# Altium project Version 1.PrjPcb
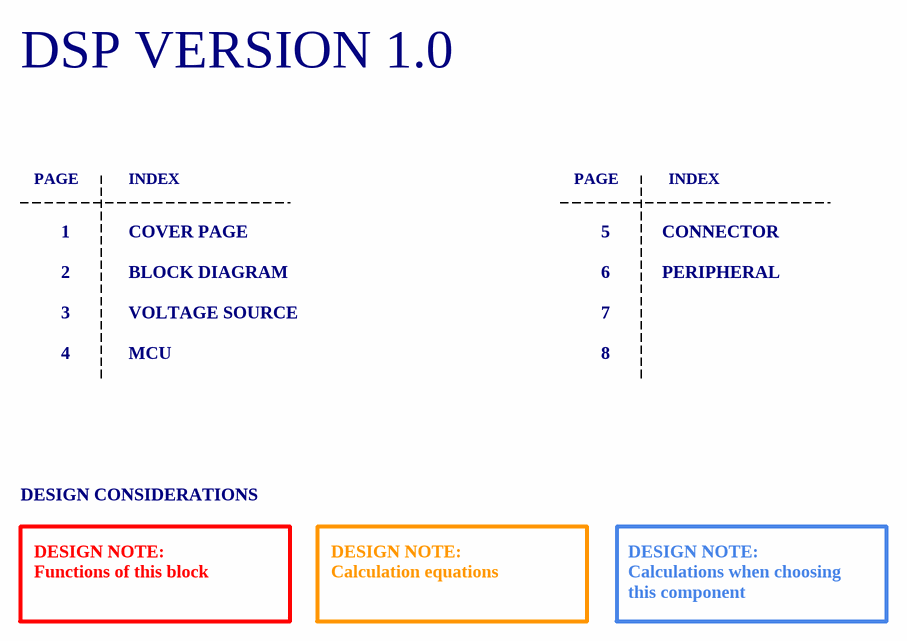
[diagram p0: Cover Page.SchDoc]
6 sheets, 80 parts. Net scope: global (net labels, ports and power ports of the same name join across sheets).
Board file: PCB_cut_wire.PcbDoc
Sheets:
  Cover Page.SchDoc
  Block Diagram.SchDoc
  Voltage Source.SchDoc
  Micro Controller.SchDoc
  Peripheral.SchDoc
  Connector.SchDoc

## Sheet Cover Page.SchDoc: Cover Page
size A4; Author: DODANHLUONG; Revision: 1.0; SheetNumber: 1; SheetTotal: 6; ProjectTitle: DSP_VERSION_1.0

### Notes on the sheet
- DSP VERSION 1.0
- PAGE
- INDEX
- 1
- 2
- COVER PAGE
- BLOCK DIAGRAM
- 5
- 6
- CONNECTOR
- PERIPHERAL
- 3
- 4
- VOLTAGE SOURCE
- MCU
- 7
- 8
- DESIGN CONSIDERATIONS
- DESIGN NOTE:
  Functions of this block
- DESIGN NOTE:
  Calculation equations
- DESIGN NOTE:
  Calculations when choosing this component
- Author:
- Title:
- Size:
- A4
- Project:
- Approved:
- Revision:
- Modified Date:
- CONFIDENTIAL
- Date:
- SW Version:

## Sheet Block Diagram.SchDoc
size A4; SheetNumber: 2; SheetTotal: 6; ProjectTitle: DSP_VERSION_1.0

### Notes on the sheet
- Author:
- Title:
- Size:
- A4
- Project:
- Approved:
- Revision:
- Modified Date:
- CONFIDENTIAL
- Date:
- SW Version:

## Sheet Voltage Source.SchDoc
size A3; SheetNumber: 3; SheetTotal: 6; ProjectTitle: DSP_VERSION_1.0
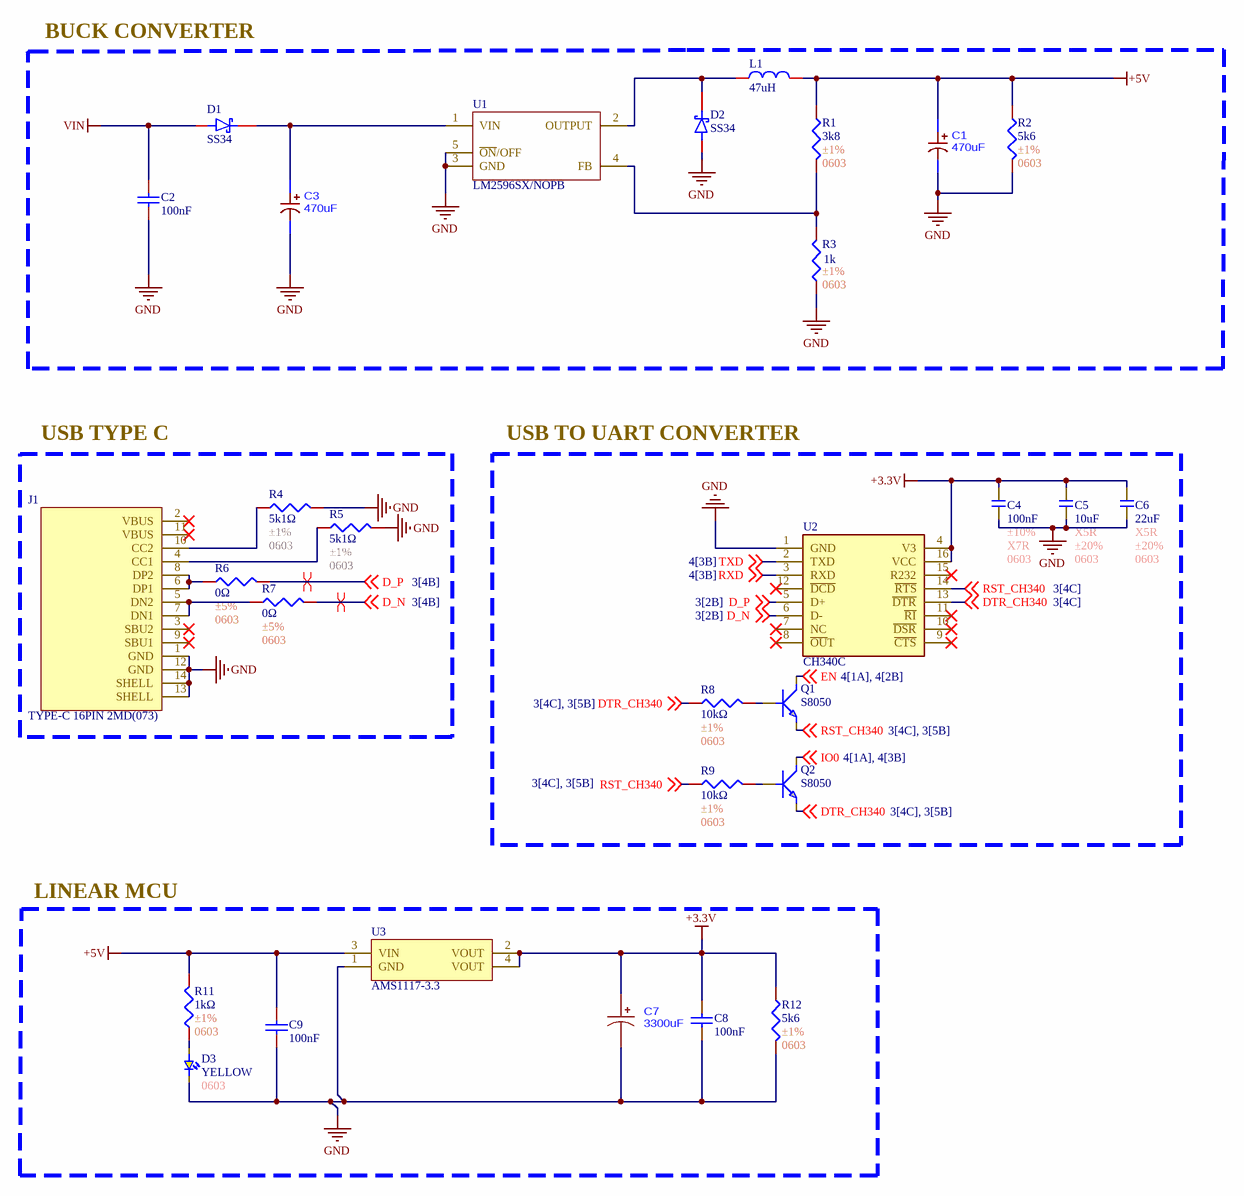
[diagram p1: Voltage Source.SchDoc]

### Parts
C1  470uF  [470uF 35V, D10xL13mm]
C2  100nF  [tu tantalum dip5.08]
C3  470uF  [470uF 35V, D10xL13mm]
C4  100nF  Tolerance: ±10%  Temperature Coefficient: X7R  Package: 0603  [C0603]
C5  10uF  Temperature Coefficient: X5R  Tolerance: ±20%  Package: 0603  [C0603]
C6  22uF  Temperature Coefficient: X5R  Tolerance: ±20%  Package: 0603  [C0603]
C7  3300uF  [Through Hole,D8xL16mm]
C8  100nF  [tu tantalum dip5.08]
C9  100nF  [tu tantalum dip5.08]
D1  SS34  [SS34]
D2  SS34  [SS34]
D3  YELLOW  Package: 0603  [LED0603]
J1  TYPE-C 16PIN 2MD(073)  [TYPE_C_FAMALE]
L1  47uH  [CD43]
Q1  S8050  [S8050]
Q2  S8050  [S8050]
R1  3k8  Tolerance: ±1%  Package: 0603  [R0603]
R2  5k6  Tolerance: ±1%  Package: 0603  [R0603]
R3  1k  Tolerance: ±1%  Package: 0603  [R0603]
R4  5k1Ω  Tolerance: ±1%  Package: 0603  [R0603]
R5  5k1Ω  Tolerance: ±1%  Package: 0603  [R0603]
R6  0Ω  Tolerance: ±5%  Package: 0603  [R0603]
R7  0Ω  Tolerance: ±5%  Package: 0603  [R0603]
R8  10kΩ  Tolerance: ±1%  Package: 0603  [R0603]
R9  10kΩ  Tolerance: ±1%  Package: 0603  [R0603]
R11  1kΩ  Tolerance: ±1%  Package: 0603  [R0603]
R12  5k6  Tolerance: ±1%  Package: 0603  [R0603]
U1  LM2596SX/NOPB  [LM2596SX-5.0/NOPB]
U2  CH340C  [CH340C]
U3  AMS1117-3.3  [AMS1117-3.3]

### Blocks framed on the sheet
BUCK CONVERTER: C1-C3 D1 D2 L1 R1-R3 U1
USB TYPE C: J1 R4-R7
USB TO UART CONVERTER: C4-C6 Q1 Q2 R8 R9 U2
LINEAR MCU: C7-C9 D3 R11 R12 U3

### Nets
+3.3V: C4.2 C5.2 C6.2 C7.1 C8.2 R12.1 U2.4(V3) U2.16(VCC) U3.2(VOUT) U3.4(VOUT)
+5V: C1.1 C9.2 L1.2 R1.1 R2.1 R11.2 U3.3(VIN)
GND: C1.2 C2.1 C3.2 C4.1 C5.1 C6.1 C7.2 C8.1 C9.1 D2.2 D3.1 J1.1(GND) J1.12(GND) J1.13(SHELL) J1.14(SHELL) R2.2 R3.1 R4.2 R5.2 R12.2 U1.3(GND) U1.5(~{ON}/OFF) U2.1(GND) U3.1(GND)
VIN: C2.2 D1.2
D_N: R7.2 U2.6(D-) ; off-sheet D_N
D_P: R6.2 U2.5(D+) ; off-sheet D_P
DTR_CH340: Q2.2(E) R8.1 U2.13(~{DTR}) ; off-sheet DTR_CH340
EN: Q1.3(C) ; off-sheet EN
IO0: Q2.3(C) ; off-sheet IO0
RST_CH340: Q1.2(E) R9.1 U2.14(~{RTS}) ; off-sheet RST_CH340
RXD: U2.3(RXD) ; off-sheet RXD
TXD: U2.2(TXD) ; off-sheet TXD
NetC3_1: C3.1 D1.1 U1.1(VIN)
NetD2_1: D2.1 L1.1 U1.2(OUTPUT)
NetD3_2: D3.2 R11.1
NetJ1_4: J1.4(CC1) R5.1
NetJ1_5: J1.5(DN2) J1.7(DN1) R7.1
NetJ1_6: J1.6(DP1) J1.8(DP2) R6.1
NetJ1_10: J1.10(CC2) R4.1
NetQ1_1: Q1.1(B) R8.2
NetQ2_1: Q2.1(B) R9.2
NetR1_2: R1.2 R3.2 U1.4(FB)

Not connected (* = marked no-connect by the designer): J1 2(VBUS)* 3(SBU2)* 9(SBU1)* 11(VBUS)*; U2 7(NC)* 8(~{OU}T)* 9(~{CTS})* 10(~{DSR})* 11(~{RI})* 12(~{DCD})* 15(R232)*

### Layout directives
differential pair: D_N, D_P

### Notes on the sheet
- Author:
- Title:
- Size:
- A3
- Project:
- Revision:
- Modified Date:
- CheckedBy:
- Date:
- SW Version:

### Library data of the parts
C1 C3 = 470uF  35V, D10xL13mm: 470uF ±20% 35V Through Hole,D10xL13mm; Manufacturer: AISHI; Mfr. Part #: SPZ1VM471G13O00RAXXX; Key Attributes: CAP ALUM POLY 470uF ±20% 35V TH; LCSC Part #: C2691847; Package: Through Hole,D10xL13mm; Link: https://www.lcsc.com/product-detail/C2691847.html
C2 C8 C9 = Tu tantalum 100nF 50V 20% DIP5.08: Cắm; Don_Vi: Con; So_Chan: 2; Ten_Linh_Kien: Tụ tantalum 104-100nF 50V 20% DIP5.08 (sứ vàng)(10PCS); Ma_Hang: MH003955; Chung_Loai: Cắm; Kieu_Chan: *
C4 = C0603_100nF_±10%_X7R: 50V 100nF X7R ±10% 0603 Multilayer Ceramic Capacitors MLCC - SMD/SMT ROHS; Manufacturer: YAGEO; Mfr. Part #: CC0603KRX7R9BB104; LCSC Part #: C14663; Capacitance: 100nF; Link: https://www.lcsc.com/product-detail/C14663.html?s_z=n_capital%25200603%2520100nf
C5 = C0603_10uF_±10%_X7R: 25V 10uF X5R ±20% 0603 Multilayer Ceramic Capacitors MLCC - SMD/SMT ROHS; Manufacturer: YAGEO; Mfr. Part #: CC0603MRX5R8BB106; LCSC Part #: C596327; Capacitance: 10uF; Link: https://www.lcsc.com/product-detail/C596327.html?s_z=n_capital%25200603%252010uF%2520yageo
C6 = C0603_22uF_±20%_X5R: 6.3V 22uF X5R ±20% 0603 Multilayer Ceramic Capacitors MLCC - SMD/SMT ROHS; Manufacturer: YAGEO; Mfr. Part #: CC0603MRX5R5BB226; LCSC Part #: C109448; ComponentLink1Description: New link; ComponentLink1URL: *; Capacitance: 22uF; Link: https://www.lcsc.com/product-detail/C109448.html?s_z=n_capital%25200603%252022uf%2520yageo
C7 = Through Hole,D8xL16mm: 3300uF ±20% 6.3V Through Hole,D8xL16mm 2000hrs; Manufacturer: Honor Elec; Mfr. Part #: HS0J338M0816PC; Key Attributes: CAP ALUM POLY 3300uF ±20% 6.3V TH; LCSC Part #: C5438512; Package: Through Hole,D8xL16mm; Link: https://www.lcsc.com/product-detail/C5438512.html
D1 D2 = SS34: 40V Independent 3A 550mV@3A SMA(DO-214AC) Schottky Diodes ROHS; Manufacturer: MDD(Microdiode Semiconductor); Mfr. Part #: SS34; LCSC Part #: C8678; Package: SMA(DO-214AC); Voltage - DC Reverse(Vr): 40V; Current - Rectified: 3A; Link: https://www.lcsc.com/product-detail/C8678.html?s_z=n_SS34
D3 = D0603_YELLOW: 25mcd~40mcd Water Clear -40℃~+85℃ 624nm Red 120° 60mW 0402 LED Indication - Discrete ROHS; Manufacturer: XINGLIGHT; Mfr. Part #: XL-1005UGC; Voltage - Forward(Vf): 3V; LCSC Part #: C965793; Power(Watts): 60mW; Link: https://www.lcsc.com/product-detail/C136765.html?s_z=n_LED%25200402%2520RED; Illumination Color: YELLOW
J1 = TYPE_C_FAMALE_16PIN: 3A 1 Surface Mount, Right Angle 16P Female -25℃~+85℃ Type-C SMD USB Connectors ROHS; Manufacturer: SHOU HAN; Mfr. Part #: TYPE-C 16PIN 2MD(073); LCSC Part #: C2765186; Package: SMD; Number of Contacts: 16P; Link: https://www.lcsc.com/product-detail/C2765186.html?s_z=n_type%2520c
L1 = CD4-10UH: 1.15A 10uH Unshielded Inductor ±20% SMD,4x4.5mm Power Inductors ROHS; Manufacturer: ZE; Mfr. Part #: CD43-100M; Key Attributes: FIXED IND 10uH 1.15A 182mΩ SMD,4x4.5mm; DC Resistance(DCR): 182mΩ; LCSC Part #: C18734467; Package: SMD,4x4.5mm; Link: https://www.lcsc.com/product-detail/C18734467.html?s_z=n_CD43%252010uH; Tolerance: ±20%; Current Rating: 1.15A; Inductance: 10uH
Q1 Q2 = S8050: 25V 300mW 500mA SOT-23 Bipolar (BJT) ROHS; Manufacturer: JSMSEMI; Key Attributes: TRANS 25V 500mA SOT-23; Transition frequency(fT): 150MHz; Vce Saturation(VCE(sat)): 600mV; Mfr. Part #: S8050; LCSC Part #: C916390; Package: SOT-23; Link: https://www.lcsc.com/product-detail/C916390.html?s_z=n_s8050; Current - Collector(Ic): 500mA
R1-R3 R12 = R0603_4k7Ω_±1%: 62.5mW Thick Film Resistor 50V ±1% ±200ppm/℃ 10Ω 0402 Chip Resistor - Surface Mount ROHS; Manufacturer: YAGEO; Mfr. Part #: RC0402FR-0710RL; Resistance: 4k7Ω; LCSC Part #: C138066; Link: https://www.lcsc.com/product-detail/C138066.html?s_z=n_resistor%25200402%252010R
R4 R5 = R0603_5k1Ω_±1%: 100mW Thick Film Resistor 75V ±100ppm/℃ ±1% 5.1kΩ 0603 Chip Resistor - Surface Mount ROHS; Manufacturer: FOJAN; Mfr. Part #: FRC0603F5101TS; Key Attributes: RES 5.1kΩ ±1% 100mW 0603; LCSC Part #: C2907044; Link: https://www.lcsc.com/product-detail/C2907044.html?s_z=n_5k1%25200603; Resistance: 5k1Ω
R6 R7 = R0603_0Ω_±5%: 100mW Thick Film Resistor 75V ±5% 0Ω 0603 Chip Resistor - Surface Mount ROHS; Manufacturer: YAGEO; Mfr. Part #: RC0603JR-070RL; Key Attributes: RES 0Ω ±5% 100mW 0603; LCSC Part #: C95177; Resistance: 0Ω; Link: https://www.lcsc.com/product-detail/C138066.html?s_z=n_resistor%25200402%252010R
R8 R9 = R0603_10kΩ_±1%: 62.5mW Thick Film Resistor 50V ±1% ±200ppm/℃ 10Ω 0402 Chip Resistor - Surface Mount ROHS; Manufacturer: YAGEO; Mfr. Part #: RC0402FR-0710RL; LCSC Part #: C138066; Resistance: 10kΩ; Link: https://www.lcsc.com/product-detail/C138066.html?s_z=n_resistor%25200402%252010R
R11 = R0603_1kΩ_±1%: 62.5mW Thick Film Resistor 50V ±1% ±200ppm/℃ 10Ω 0402 Chip Resistor - Surface Mount ROHS; Manufacturer: YAGEO; Mfr. Part #: RC0402FR-0710RL; LCSC Part #: C138066; Resistance: 1kΩ; Link: https://www.lcsc.com/product-detail/C138066.html?s_z=n_resistor%25200402%252010R
U1 = LM2596SX/NOPB: 150kHz Buck Fixed 1 TO-263-5 Voltage Regulators - DC DC Switching Regulators RoHS; Manufacturer: TI; Key Attributes: LM2596 SIMPLE SWITCHER 3A Step-Down Voltage Regulator; Mfr. Part #: LM2596SX/NOPB; LCSC Part #: C10002; Package: TO-263-5; Link: https://www.lcsc.com/product-detail/C10002.html?s_z=n_lm2596
U2 = CH340C: 2Mbps Transceiver USB 2.0 SOP-16 USB Converters ROHS; Manufacturer: WCH; Voltage - Supply: 3.3V;5V; LCSC Part #: C84681; Package: SOP-16; Link: https://www.lcsc.com/product-detail/C84681.html?s_z=n_CH340C; Mfr. Part #: CH340C
U3 = AMS1117-3.3: 72dB@(120Hz) 1A Fixed 3.3V Positive 16V SOT-223 Voltage Regulators - Linear, Low Drop Out (LDO) Regulators ROHS; Manufacturer: Advanced Monolithic Systems; LCSC Part #: C6186; Link: https://www.lcsc.com/product-detail/C6186.html?s_z=n_ams1117-3.3; Output Current: 1A; Package: SOT-223; Mfr. Part #: AMS1117-3.3

## Sheet Micro Controller.SchDoc
size A4; SheetNumber: 4; SheetTotal: 6; ProjectTitle: DSP_VERSION_1.0
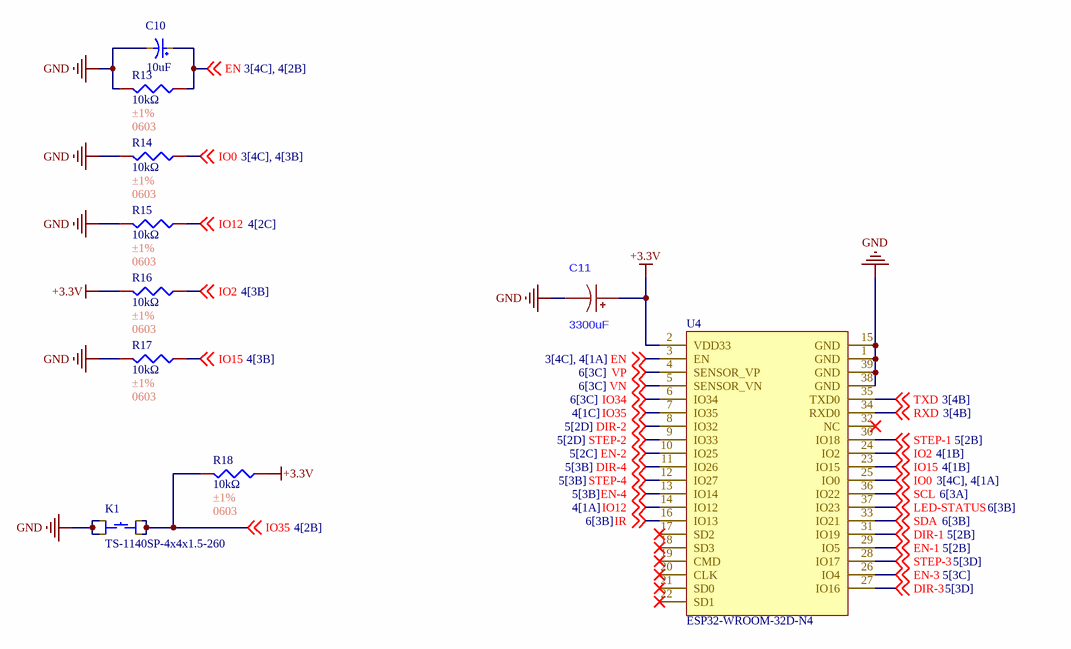
[diagram p2: Micro Controller.SchDoc]

### Parts
C10  10uF  [C_TH_5x11mm]
C11  3300uF  [Through Hole,D8xL16mm]
K1  TS-1140SP-4x4x1.5-260  [4x4x1.5]
R13  10kΩ  Tolerance: ±1%  Package: 0603  [R0603]
R14  10kΩ  Tolerance: ±1%  Package: 0603  [R0603]
R15  10kΩ  Tolerance: ±1%  Package: 0603  [R0603]
R16  10kΩ  Tolerance: ±1%  Package: 0603  [R0603]
R17  10kΩ  Tolerance: ±1%  Package: 0603  [R0603]
R18  10kΩ  Tolerance: ±1%  Package: 0603  [R0603]
U4  ESP32-WROOM-32D-N4  [ESP32-WROOM-32D-N4]

### Nets
+3.3V: C11.1 R16.2 R18.1 U4.2(VDD33)
GND: C10.2 C11.2 K1.1 K1.3 R13.2 R14.2 R15.2 R17.2 U4.1(GND) U4.15(GND) U4.38(GND) U4.39(GND)
DIR-1: U4.31(IO19) ; off-sheet DIR-1
DIR-2: U4.8(IO32) ; off-sheet DIR-2
DIR-3: U4.27(IO16) ; off-sheet DIR-3
DIR-4: U4.11(IO26) ; off-sheet DIR-4
EN: C10.1 R13.1 U4.3(EN) ; off-sheet EN
EN-1: U4.29(IO5) ; off-sheet EN-1
EN-2: U4.10(IO25) ; off-sheet EN-2
EN-3: U4.26(IO4) ; off-sheet EN-3
EN-4: U4.13(IO14) ; off-sheet EN-4
IO0: R14.1 U4.25(IO0) ; off-sheet IO0
IO2: R16.1 U4.24(IO2) ; off-sheet IO2
IO12: R15.1 U4.14(IO12) ; off-sheet IO12
IO15: R17.1 U4.23(IO15) ; off-sheet IO15
IO34: U4.6(IO34) ; off-sheet IO34
IO35: K1.2 K1.4 R18.2 U4.7(IO35) ; off-sheet IO35
IR: U4.16(IO13) ; off-sheet IR
LED-STATUS: U4.37(IO23) ; off-sheet LED-STATUS
RXD: U4.34(RXD0) ; off-sheet RXD
SCL: U4.36(IO22) ; off-sheet SCL
SDA: U4.33(IO21) ; off-sheet SDA
STEP-1: U4.30(IO18) ; off-sheet STEP-1
STEP-2: U4.9(IO33) ; off-sheet STEP-2
STEP-3: U4.28(IO17) ; off-sheet STEP-3
STEP-4: U4.12(IO27) ; off-sheet STEP-4
TXD: U4.35(TXD0) ; off-sheet TXD
VN: U4.5(SENSOR_VN) ; off-sheet VN
VP: U4.4(SENSOR_VP) ; off-sheet VP

Not connected (* = marked no-connect by the designer): U4 17(SD2)* 18(SD3)* 19(CMD)* 20(CLK)* 21(SD0)* 22(SD1)* 32(NC)*

### Notes on the sheet
- Author:
- Title:
- Size:
- A4
- Project:
- Approved:
- Revision:
- Modified Date:
- CONFIDENTIAL
- Date:
- SW Version:

### Library data of the parts
C10 = C_10uF_5x11TH: 10uF 50V ±20% Through Hole,D5xL11mm Aluminum Electrolytic Capacitors - Leaded ROHS; Manufacturer: Rubycon; Mfr. Part #: 50YXF10MEFC5X11; Key Attributes: CAP ALUM 10uF ±20% 50V TH; Pin Spacing: 2mm; LCSC Part #: C88726; Package: Through Hole,D5xL11mm; Tolerance: ±20%; Voltage Rating: 50V; Capacitance: 10uF; Link: https://www.lcsc.com/product-detail/C88726.html?s_z=n_electrolytic%252010uF
C11 = Through Hole,D8xL16mm: as C7 on sheet Voltage Source; LCSC Part #: C5438512; Package: Through Hole,D8xL16mm; Link: https://www.lcsc.com/product-detail/C5438512.html
K1 = TS-1140SP-4x4x1.5-260: SMD Tactile Switches ROHS; Manufacturer: CAX; Mfr. Part #: TS-1140SP-4x4x1.5-260; LCSC Part #: C49023394; Package: SMD; Link: https://www.lcsc.com/product-detail/C49023394.html?s_z=n_button%25204x4
R13-R18 = R0603_10kΩ_±1%: as R8 on sheet Voltage Source; LCSC Part #: C138066; Resistance: 10kΩ; Link: https://www.lcsc.com/product-detail/C138066.html?s_z=n_resistor%25200402%252010R
U4 = ESPRESSIF ESP32-WROOM-32D-N4: SMD,18x25.5mm WiFi Modules ROHS; Manufacturer: ESPRESSIF; Mfr. Part #: ESP32-WROOM-32D-N4; LCSC Part #: C473012; Package: SMD,18x25.5mm; Link: https://www.lcsc.com/product-detail/C473012.html?s_z=n_esp32-wroom-32d

## Sheet Peripheral.SchDoc
size A4; SheetNumber: 5; SheetTotal: 6; ProjectTitle: DSP_VERSION_1.0
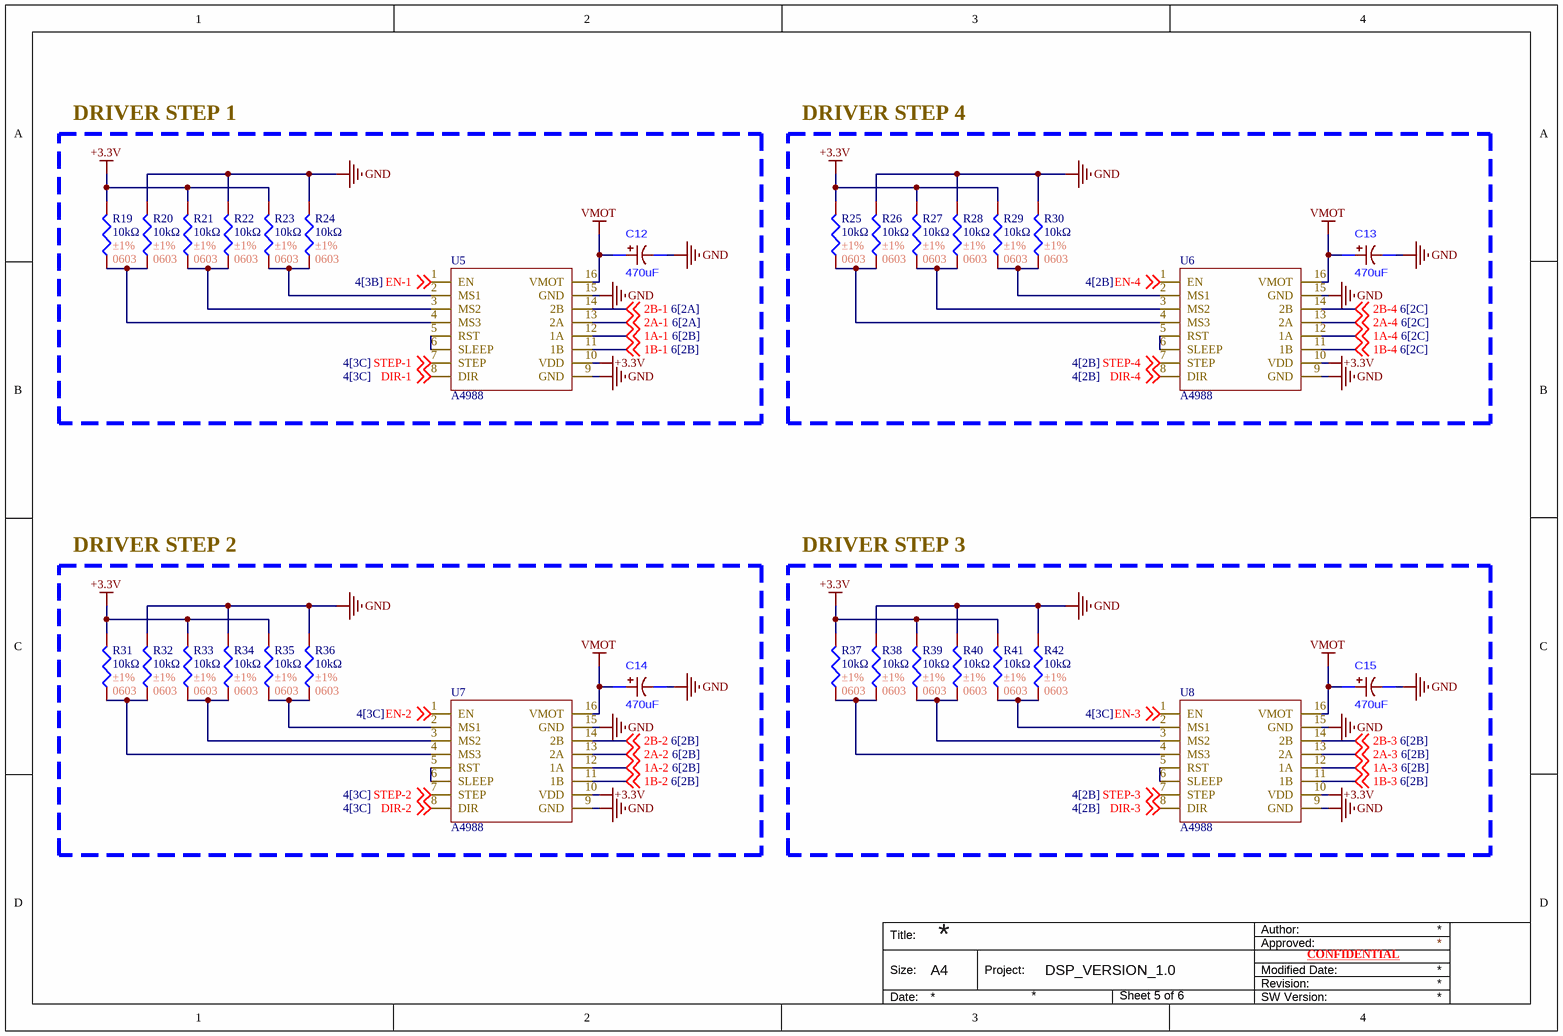
[diagram p3: Peripheral.SchDoc]

### Parts
C12  470uF  [470uF 35V, D10xL13mm]
C13  470uF  [470uF 35V, D10xL13mm]
C14  470uF  [470uF 35V, D10xL13mm]
C15  470uF  [470uF 35V, D10xL13mm]
R19  10kΩ  Tolerance: ±1%  Package: 0603  [R0603]
R20  10kΩ  Tolerance: ±1%  Package: 0603  [R0603]
R21  10kΩ  Tolerance: ±1%  Package: 0603  [R0603]
R22  10kΩ  Tolerance: ±1%  Package: 0603  [R0603]
R23  10kΩ  Tolerance: ±1%  Package: 0603  [R0603]
R24  10kΩ  Tolerance: ±1%  Package: 0603  [R0603]
R25  10kΩ  Tolerance: ±1%  Package: 0603  [R0603]
R26  10kΩ  Tolerance: ±1%  Package: 0603  [R0603]
R27  10kΩ  Tolerance: ±1%  Package: 0603  [R0603]
R28  10kΩ  Tolerance: ±1%  Package: 0603  [R0603]
R29  10kΩ  Tolerance: ±1%  Package: 0603  [R0603]
R30  10kΩ  Tolerance: ±1%  Package: 0603  [R0603]
R31  10kΩ  Tolerance: ±1%  Package: 0603  [R0603]
R32  10kΩ  Tolerance: ±1%  Package: 0603  [R0603]
R33  10kΩ  Tolerance: ±1%  Package: 0603  [R0603]
R34  10kΩ  Tolerance: ±1%  Package: 0603  [R0603]
R35  10kΩ  Tolerance: ±1%  Package: 0603  [R0603]
R36  10kΩ  Tolerance: ±1%  Package: 0603  [R0603]
R37  10kΩ  Tolerance: ±1%  Package: 0603  [R0603]
R38  10kΩ  Tolerance: ±1%  Package: 0603  [R0603]
R39  10kΩ  Tolerance: ±1%  Package: 0603  [R0603]
R40  10kΩ  Tolerance: ±1%  Package: 0603  [R0603]
R41  10kΩ  Tolerance: ±1%  Package: 0603  [R0603]
R42  10kΩ  Tolerance: ±1%  Package: 0603  [R0603]
U5  A4988  [A4988-driver_step]
U6  A4988  [A4988-driver_step]
U7  A4988  [A4988-driver_step]
U8  A4988  [A4988-driver_step]

### Nets
+3.3V: R19.2 R21.2 R23.2 R25.2 R27.2 R29.2 R31.2 R33.2 R35.2 R37.2 R39.2 R41.2 U5.10(VDD) U6.10(VDD) U7.10(VDD) U8.10(VDD)
GND: C12.2 C13.2 C14.2 C15.2 R20.2 R22.2 R24.2 R26.2 R28.2 R30.2 R32.2 R34.2 R36.2 R38.2 R40.2 R42.2 U5.9(GND) U5.15(GND) U6.9(GND) U6.15(GND) U7.9(GND) U7.15(GND) U8.9(GND) U8.15(GND)
VMOT: C12.1 C13.1 C14.1 C15.1 U5.16(VMOT) U6.16(VMOT) U7.16(VMOT) U8.16(VMOT)  [project net VIN]
1A-1: U5.12(1A) ; off-sheet 1A-1
1A-2: U7.12(1A) ; off-sheet 1A-2
1A-3: U8.12(1A) ; off-sheet 1A-3
1A-4: U6.12(1A) ; off-sheet 1A-4
1B-1: U5.11(1B) ; off-sheet 1B-1
1B-2: U7.11(1B) ; off-sheet 1B-2
1B-3: U8.11(1B) ; off-sheet 1B-3
1B-4: U6.11(1B) ; off-sheet 1B-4
2A-1: U5.13(2A) ; off-sheet 2A-1
2A-2: U7.13(2A) ; off-sheet 2A-2
2A-3: U8.13(2A) ; off-sheet 2A-3
2A-4: U6.13(2A) ; off-sheet 2A-4
2B-1: U5.14(2B) ; off-sheet 2B-1
2B-2: U7.14(2B) ; off-sheet 2B-2
2B-3: U8.14(2B) ; off-sheet 2B-3
2B-4: U6.14(2B) ; off-sheet 2B-4
DIR-1: U5.8(DIR) ; off-sheet DIR-1
DIR-2: U7.8(DIR) ; off-sheet DIR-2
DIR-3: U8.8(DIR) ; off-sheet DIR-3
DIR-4: U6.8(DIR) ; off-sheet DIR-4
EN-1: U5.1(EN) ; off-sheet EN-1
EN-2: U7.1(EN) ; off-sheet EN-2
EN-3: U8.1(EN) ; off-sheet EN-3
EN-4: U6.1(EN) ; off-sheet EN-4
STEP-1: U5.7(STEP) ; off-sheet STEP-1
STEP-2: U7.7(STEP) ; off-sheet STEP-2
STEP-3: U8.7(STEP) ; off-sheet STEP-3
STEP-4: U6.7(STEP) ; off-sheet STEP-4
NetR19_1: R19.1 R20.1 U5.4(MS3)
NetR21_1: R21.1 R22.1 U5.3(MS2)
NetR23_1: R23.1 R24.1 U5.2(MS1)
NetR25_1: R25.1 R26.1 U6.4(MS3)
NetR27_1: R27.1 R28.1 U6.3(MS2)
NetR29_1: R29.1 R30.1 U6.2(MS1)
NetR31_1: R31.1 R32.1 U7.4(MS3)
NetR33_1: R33.1 R34.1 U7.3(MS2)
NetR35_1: R35.1 R36.1 U7.2(MS1)
NetR37_1: R37.1 R38.1 U8.4(MS3)
NetR39_1: R39.1 R40.1 U8.3(MS2)
NetR41_1: R41.1 R42.1 U8.2(MS1)
NetU5_5: U5.5(RST) U5.6(SLEEP)
NetU6_5: U6.5(RST) U6.6(SLEEP)
NetU7_5: U7.5(RST) U7.6(SLEEP)
NetU8_5: U8.5(RST) U8.6(SLEEP)

### Notes on the sheet
- DRIVER STEP 1
- DRIVER STEP 4
- DRIVER STEP 2
- DRIVER STEP 3
- Author:
- Title:
- Size:
- A4
- Project:
- Approved:
- Revision:
- Modified Date:
- CONFIDENTIAL
- Date:
- SW Version:

### Library data of the parts
C12-C15 = 470uF  35V, D10xL13mm: as C1 on sheet Voltage Source; LCSC Part #: C2691847; Package: Through Hole,D10xL13mm; Link: https://www.lcsc.com/product-detail/C2691847.html
R19-R42 = R0603_10kΩ_±1%: as R8 on sheet Voltage Source; LCSC Part #: C138066; Resistance: 10kΩ; Link: https://www.lcsc.com/product-detail/C138066.html?s_z=n_resistor%25200402%252010R
U5-U8 = Module_A4988

## Sheet Connector.SchDoc
size A4; SheetNumber: 6; SheetTotal: 6; ProjectTitle: DSP_VERSION_1.0
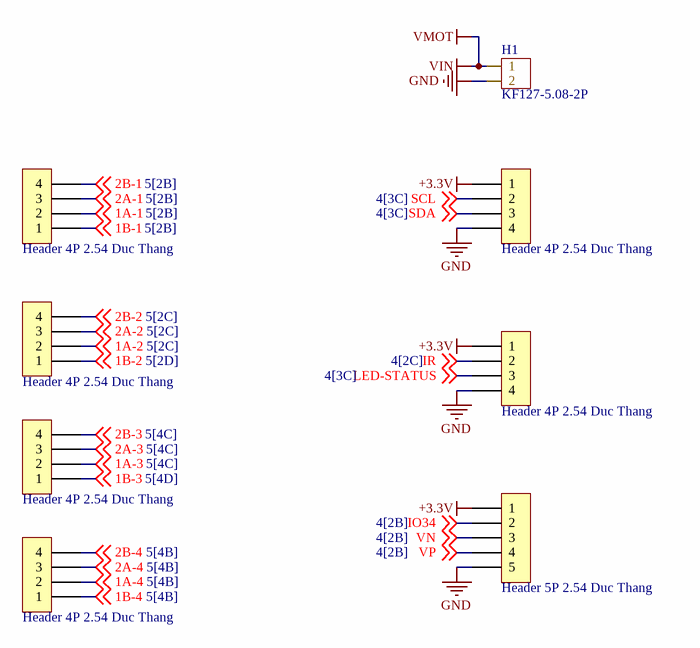
[diagram p4: Connector.SchDoc]

### Parts
H1  KF127-5.08-2P  [KF127-5.08-2P]
H3  Header 4P 2.54 Duc Thang  [XH2.54M-4]
H4  Header 4P 2.54 Duc Thang  [XH2.54M-4]
H5  Header 4P 2.54 Duc Thang  [XH2.54M-4]
H6  Header 4P 2.54 Duc Thang  [XH2.54M-4]
H7  Header 4P 2.54 Duc Thang  [XH2.54M-4]
H8  Header 5P 2.54 Duc Thang  [XH2.54M-5]
H9  Header 4P 2.54 Duc Thang  [XH2.54M-4]

### Nets
+3.3V: H4.1 H6.1 H8.1
GND: H1.2 H4.4 H6.4 H8.5
VIN: H1.1  [also labelled VMOT]
1A-1: H3.2 ; off-sheet 1A-1
1A-2: H5.2 ; off-sheet 1A-2
1A-3: H7.2 ; off-sheet 1A-3
1A-4: H9.2 ; off-sheet 1A-4
1B-1: H3.1 ; off-sheet 1B-1
1B-2: H5.1 ; off-sheet 1B-2
1B-3: H7.1 ; off-sheet 1B-3
1B-4: H9.1 ; off-sheet 1B-4
2A-1: H3.3 ; off-sheet 2A-1
2A-2: H5.3 ; off-sheet 2A-2
2A-3: H7.3 ; off-sheet 2A-3
2A-4: H9.3 ; off-sheet 2A-4
2B-1: H3.4 ; off-sheet 2B-1
2B-2: H5.4 ; off-sheet 2B-2
2B-3: H7.4 ; off-sheet 2B-3
2B-4: H9.4 ; off-sheet 2B-4
IO34: H8.2 ; off-sheet IO34
IR: H6.2 ; off-sheet IR
LED-STATUS: H6.3 ; off-sheet LED-STATUS
SCL: H4.2 ; off-sheet SCL
SDA: H4.3 ; off-sheet SDA
VN: H8.3 ; off-sheet VN
VP: H8.4 ; off-sheet VP

### Notes on the sheet
- Author:
- Title:
- Size:
- A4
- Project:
- Approved:
- Revision:
- Modified Date:
- CONFIDENTIAL
- Date:
- SW Version:

### Library data of the parts
H1 = KF127-5.08-2P: 1.5 1x2P 14~26 Green -40℃~+105℃ 15A 250V Through Hole 5.08mm 1 2 Through Hole,P=5.08mm Wire to Board RoHS; Manufacturer: Cixi Kefa Elec; Key Attributes: TERM BLK 2POS 5.08mm TH; Mfr. Part #: KF127-5.08-2P; LCSC Part #: C474906; Package: Through Hole,P=5.08mm; Link: https://www.lcsc.com/product-detail/C474906.html?s_z=n_kf127
H3-H7 H9 = Header 4P 2.54 Duc Thang: Cắm; Ten_Linh_Kien: Header 4P XH2.54-4P Đực Thẳng; Don_Vi: Con; Ma_Hang: MH001285; Chung_Loai: Cắm
H8 = Header 5P 2.54 Duc Thang: Cắm; Ten_Linh_Kien: Header 5P XH2.54-5P Đực Thẳng; Don_Vi: Con; Ma_Hang: MH001298; Chung_Loai: Cắm

## Nets that join several sheets
+3.3V: Voltage Source (10 pins), Micro Controller (C11.1 R16.2 R18.1 U4.2), Peripheral (16 pins), Connector (H4.1 H6.1 H8.1)
GND: Voltage Source (24 pins), Micro Controller (12 pins), Peripheral (24 pins), Connector (H1.2 H4.4 H6.4 H8.5)
VIN: Voltage Source (C2.2 D1.2), Peripheral (8 pins), Connector (H1.1)
1A-1: Peripheral (U5.12), Connector (H3.2)
1A-2: Peripheral (U7.12), Connector (H5.2)
1A-3: Peripheral (U8.12), Connector (H7.2)
1A-4: Peripheral (U6.12), Connector (H9.2)
1B-1: Peripheral (U5.11), Connector (H3.1)
1B-2: Peripheral (U7.11), Connector (H5.1)
1B-3: Peripheral (U8.11), Connector (H7.1)
1B-4: Peripheral (U6.11), Connector (H9.1)
2A-1: Peripheral (U5.13), Connector (H3.3)
2A-2: Peripheral (U7.13), Connector (H5.3)
2A-3: Peripheral (U8.13), Connector (H7.3)
2A-4: Peripheral (U6.13), Connector (H9.3)
2B-1: Peripheral (U5.14), Connector (H3.4)
2B-2: Peripheral (U7.14), Connector (H5.4)
2B-3: Peripheral (U8.14), Connector (H7.4)
2B-4: Peripheral (U6.14), Connector (H9.4)
DIR-1: Micro Controller (U4.31), Peripheral (U5.8)
DIR-2: Micro Controller (U4.8), Peripheral (U7.8)
DIR-3: Micro Controller (U4.27), Peripheral (U8.8)
DIR-4: Micro Controller (U4.11), Peripheral (U6.8)
EN: Voltage Source (Q1.3), Micro Controller (C10.1 R13.1 U4.3)
EN-1: Micro Controller (U4.29), Peripheral (U5.1)
EN-2: Micro Controller (U4.10), Peripheral (U7.1)
EN-3: Micro Controller (U4.26), Peripheral (U8.1)
EN-4: Micro Controller (U4.13), Peripheral (U6.1)
IO0: Voltage Source (Q2.3), Micro Controller (R14.1 U4.25)
IO34: Micro Controller (U4.6), Connector (H8.2)
IR: Micro Controller (U4.16), Connector (H6.2)
LED-STATUS: Micro Controller (U4.37), Connector (H6.3)
RXD: Voltage Source (U2.3), Micro Controller (U4.34)
SCL: Micro Controller (U4.36), Connector (H4.2)
SDA: Micro Controller (U4.33), Connector (H4.3)
STEP-1: Micro Controller (U4.30), Peripheral (U5.7)
STEP-2: Micro Controller (U4.9), Peripheral (U7.7)
STEP-3: Micro Controller (U4.28), Peripheral (U8.7)
STEP-4: Micro Controller (U4.12), Peripheral (U6.7)
TXD: Voltage Source (U2.2), Micro Controller (U4.35)
VN: Micro Controller (U4.5), Connector (H8.3)
VP: Micro Controller (U4.4), Connector (H8.4)